# Altium schematic sheet RF_drv_v2.SchDoc: Материнская плата
size 420 x 297 mm; DrawnBy: В.Титов; DocumentNumber: ХХХХ.468179.001 Э3; SheetNumber: 1; SheetTotal: 3; DocumentType: Схема электрическая принципиальная; Title2: Питание процессора
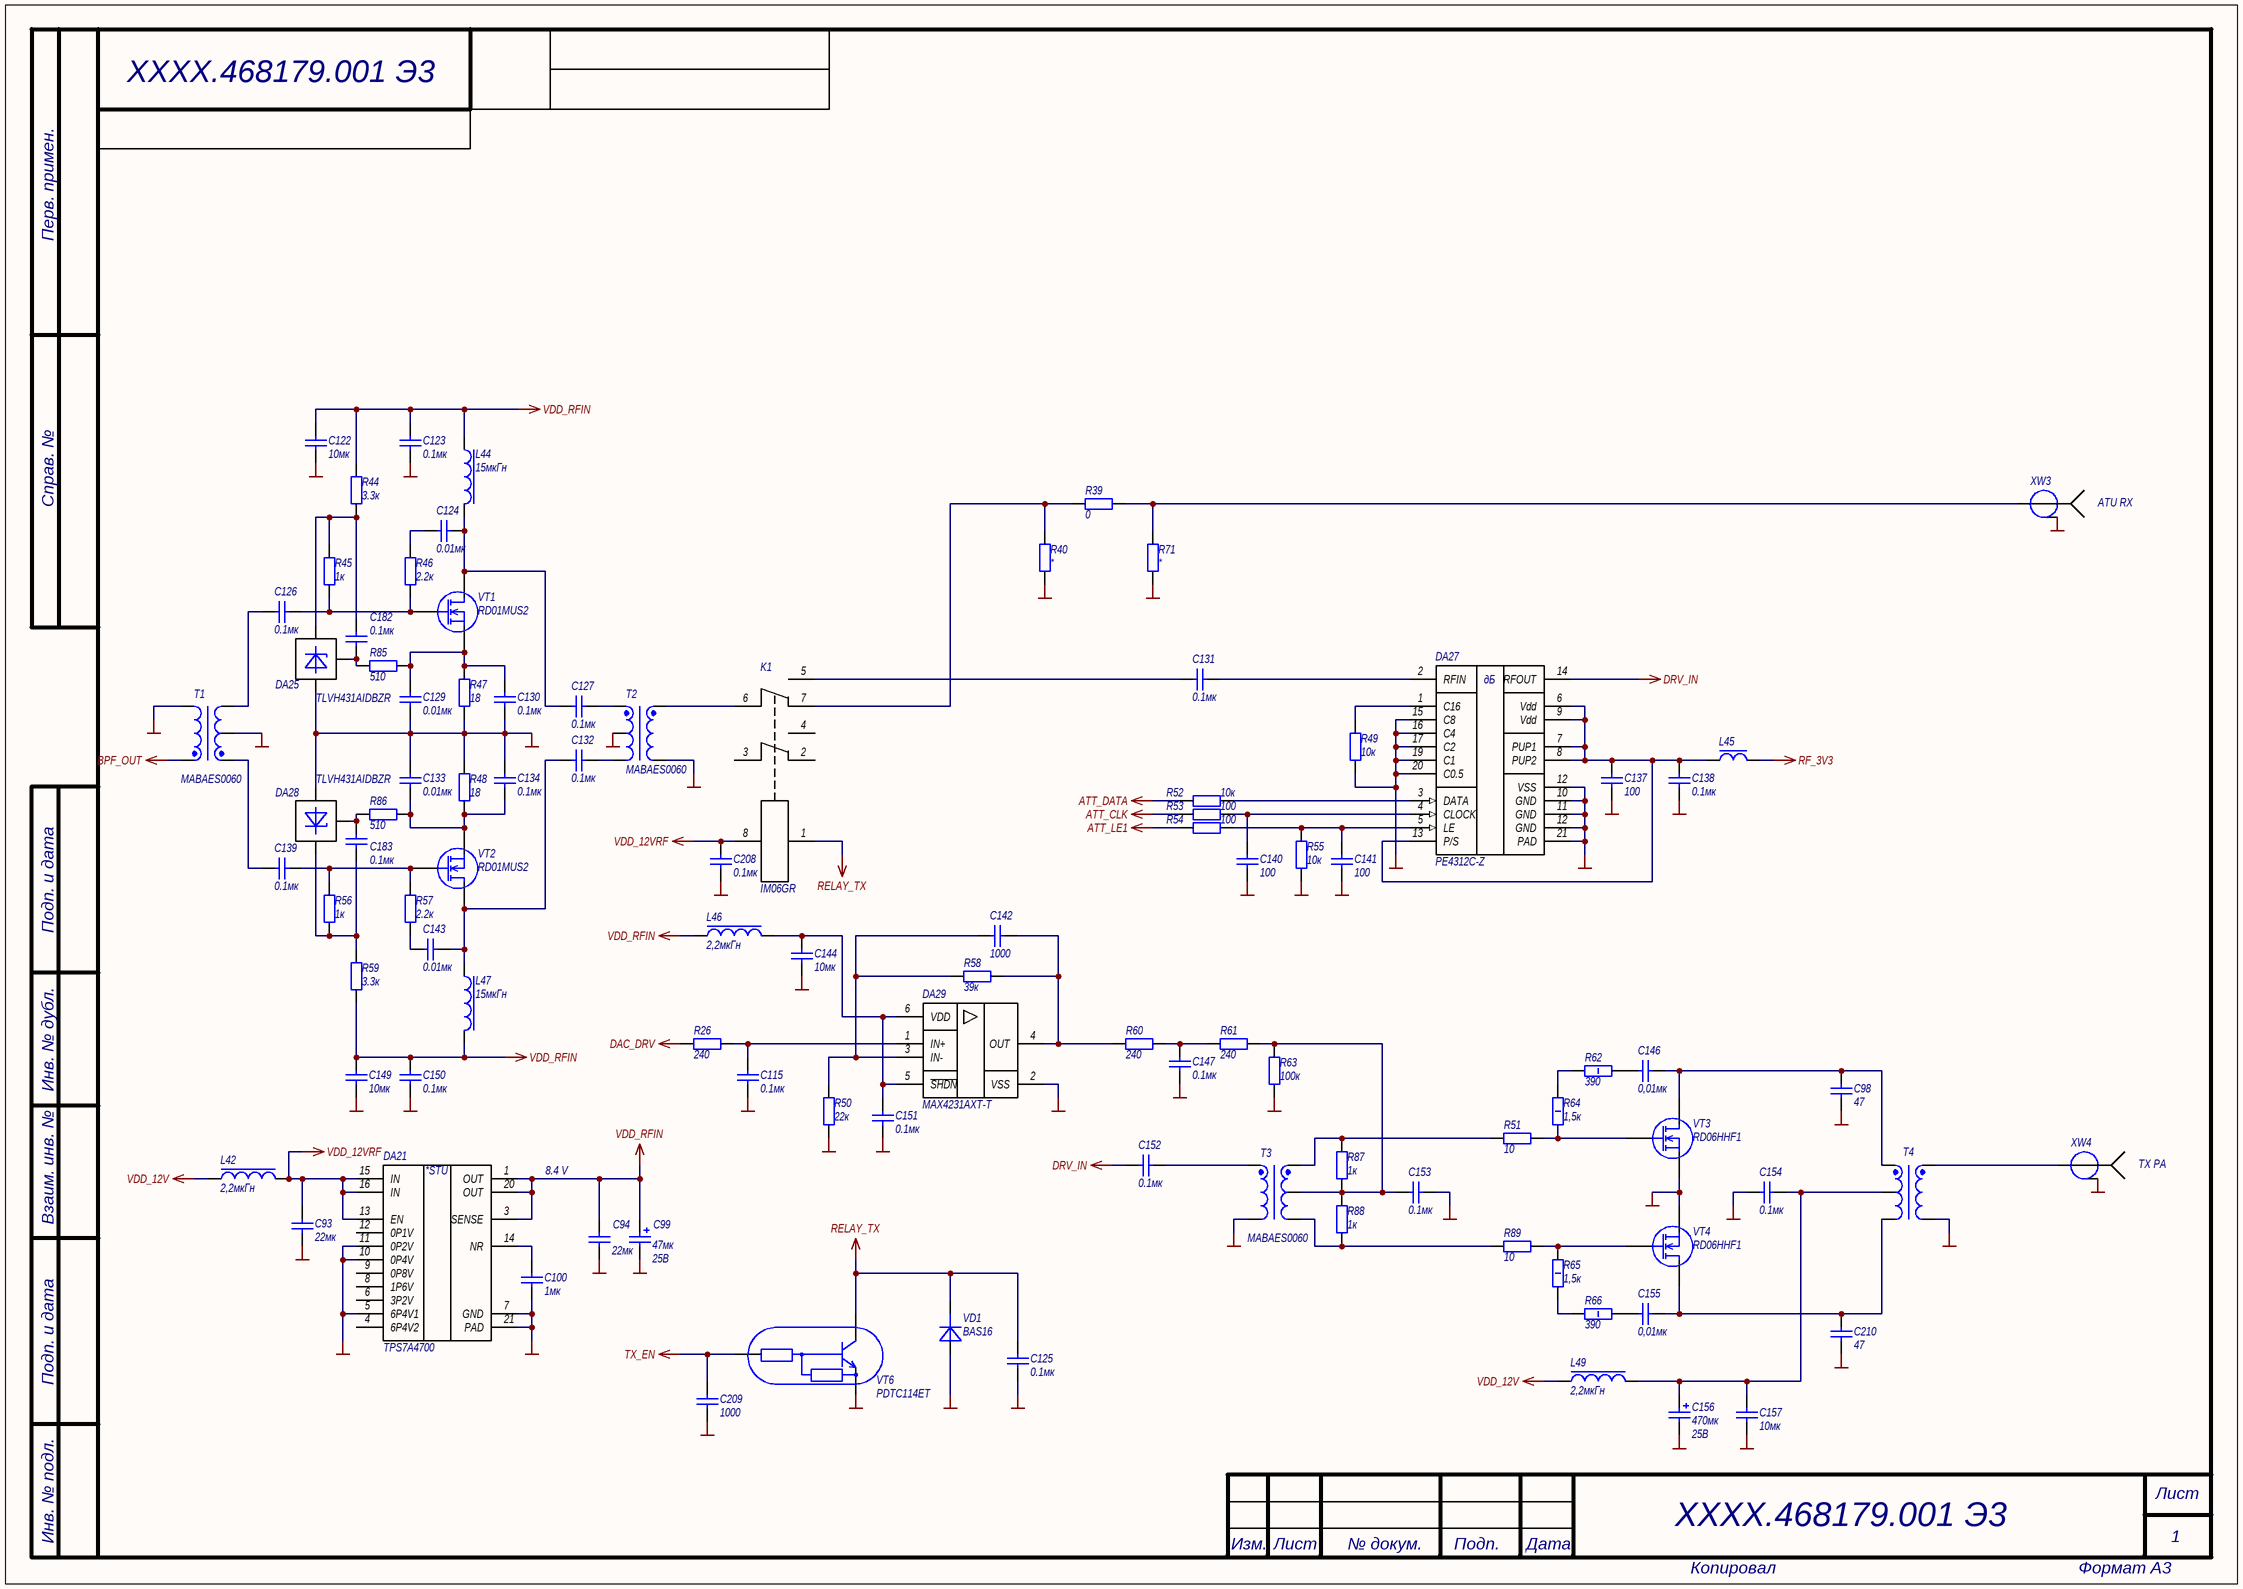
[diagram p0: RF_drv_v2.SchDoc]

## Parts
C93  22мк  [CAPC2012X12L]
C94  22мк  [CAPC2012X12L]
C98  47  [CAPC3216X19L]
C99  Power/Voltage: 25В  [CAPMP7343X28L]  (hidden comment: 47мк)
C100  1мк  [CAPC1005X06N]
C115  0.1мк  [CAPC1005X06N]
C122  10мк  [CAPC3225X27L]
C123  0.1мк  [CAPC1005X06N]
C124  0.01мк  [CAPC1005X06N]
C125  0.1мк  [CAPC1005X06N]
C126  0.1мк  [CAPC1005X06N]
C127  0.1мк  [CAPC1608X08L]
C129  0.01мк  [CAPC1005X06N]
C130  0.1мк  [CAPC1005X06N]
C131  0.1мк  [CAPC1608X08L]
C132  0.1мк  [CAPC1608X08L]
C133  0.01мк  [CAPC1005X06N]
C134  0.1мк  [CAPC1005X06N]
C137  100  [CAPC1005X06N]
C138  0.1мк  [CAPC1005X06N]
C139  0.1мк  [CAPC1005X06N]
C140  100  [CAPC1005X06N]
C141  100  [CAPC1005X06N]
C142  1000  [CAPC1005X06N]
C143  0.01мк  [CAPC1005X06N]
C144  10мк  [CAPC3225X27L]
C146  0,01мк  [CAPC2012X12L]
C147  0.1мк  [CAPC1005X06N]
C149  10мк  [CAPC3225X27L]
C150  0.1мк  [CAPC1005X06N]
C151  0.1мк  [CAPC1005X06N]
C152  0.1мк  [CAPC1608X08L]
C153  0.1мк  [CAPC1608X08L]
C154  0.1мк  [CAPC1608X08L]
C155  0,01мк  [CAPC2012X12L]
C156  Power/Voltage: 25В  [CAPAE116103X105N]  (hidden comment: 470мк)
C157  10мк  [CAPC3225X27L]
C182  0.1мк  [CAPC1005X06N]
C183  0.1мк  [CAPC1005X06N]
C208  0.1мк  [CAPC1005X06N]
C209  1000  [CAPC1005X06N]
C210  47  [CAPC3216X19L]
DA21  TPS7A4700  [QFN65P500X500X100_HS-21L]
DA25  TLVH431AIDBZR  [SOT23_N]
DA27  PE4312C-Z  [QFN50P400X400X80_HS-21L]
DA28  TLVH431AIDBZR  [SOT23_N]
DA29  MAX4231AXT-T  [TSOP65P210X100-6L]
K1  IM06GR  [IM Relay GR]
L42  2,2мкГн  [CSAB0420]
L44  15мкГн  [Coilcraft-1812FS]
L45  BLM18PG121SN1D  [INDC1608X08L]  (value not drawn)
L46  2,2мкГн  [CSAB0420]
L47  15мкГн  [Coilcraft-1812FS]
L49  2,2мкГн  [CSAB0420]
R26  240  [RESC1005X06N]
R39  0  [RESC1005X06N]
R40  *  [RESC1005X06N]
R44  3.3к  [RESC1005X06N]
R45  1к  [RESC1005X06N]
R46  2.2к  [RESC1005X06N]
R47  18  [RESC2012X05L]
R48  18  [RESC2012X05L]
R49  10к  [RESC1005X06N]
R50  22к  [RESC1005X06N]
R51  10  [RESC1005X06N]
R52  10к  [RESC1005X06N]
R53  100  [RESC1005X06N]
R54  100  [RESC1005X06N]
R55  10к  [RESC1005X06N]
R56  1к  [RESC1005X06N]
R57  2.2к  [RESC1005X06N]
R58  39к  [RESC1005X06N]
R59  3.3к  [RESC1005X06N]
R60  240  [RESC1005X06N]
R61  240  [RESC1005X06N]
R62  390  [RESC3216X04L]
R63  100к  [RESC1005X06N]
R64  1,5к  [RESC3216X04L]
R65  1,5к  [RESC3216X04L]
R66  390  [RESC3216X04L]
R71  *  [RESC1005X06N]
R85  510  [RESC1005X06N]
R86  510  [RESC1005X06N]
R87  1к  [RESC1005X06N]
R88  1к  [RESC1005X06N]
R89  10  [RESC1005X06N]
T1  MABAES0060  [SM-22 package]
T2  MABAES0060  [SM-22 package]
T3  MABAES0060  [SM-22 package]
T4  Трансформатор PUM_OUT  [Transformer_KV_PA20_0UT_2xBN-43-302_V1]  (value not drawn)
VD1  BAS16  [SOT23_N]
VT1  RD01MUS2  [SOT89-150P330X160-3N]
VT2  RD01MUS2  [SOT89-150P330X160-3N]
VT3  RD06HHF1  [TO-220HS]
VT4  RD06HHF1  [TO-220HS]
VT6  PDTC114ET  [SOT23_N]
XW3  SMA-JR  [SMA-JR]  (value not drawn)
XW4  SMA-JR  [SMA-JR]  (value not drawn)

## Nets
ATT_CLK: R53.2
ATT_DATA: R52.2
ATT_LE1: R54.2
BPF_OUT: T1.5(PRIMARY_DOT)
DAC_DRV: R26.1
DRV_IN: C152.2 DA27.14(RFOUT)
GND: C93.1 C94.1 C98.2 C99.2 C100.1 C115.2 C122.1 C123.2 C125.2 C129.2 C130.2 C133.1 C134.1 C137.1 C138.1 C140.1 C141.1 C144.1 C147.2 C149.1 C150.2 C151.2 C153.1 C154.1 C156.2 C157.1 C208.2 C209.2 C210.2 DA21.5(6P4V1) DA21.7(GND) DA21.10(0P4V) DA21.11(0P2V) DA21.21(PAD) DA25.3(A) DA27.10(GND) DA27.11(GND) DA27.12(VSS) DA27.15(C8) DA27.16(C4) DA27.17(C2) DA27.19(C1) DA27.20(C0.5) DA27.21(PAD) DA28.3(A) DA29.2(VSS) R40.2 R47.2 R48.1 R49.1 R50.1 R55.2 R63.2 R71.2 T1.2(SECONARY_CT) T1.4(PRIMARY) T2.2(SECONARY_CT) T2.4(PRIMARY) T3.4(PRIMARY) T4.5(SECONDARY) VD1.1(A) VT3.2(S) VT4.2(S) VT6.2(E) XW3.2 XW4.2
RELAY_TX: C125.1 K1.1 VD1.3(K) VT6.3(C)
RF_3V3: L45.2
TX_EN: C209.1 VT6.1(B)
VDD_12V: L42.1 L49.1
VDD_12VRF: C93.2 C208.1 DA21.13(EN) DA21.15(IN) DA21.16(IN) K1.8 L42.2
VDD_RFIN: C94.2 C99.1 C122.2 C123.1 C149.2 C150.1 DA21.1(OUT) DA21.3(SENSE) DA21.20(OUT) L44.1 L46.1 L47.2 R44.2 R59.1
NetC98_1: C98.1 C146.1 T4.3(PRIMARY_DOT) VT3.3(D)
NetC100_2: C100.2 DA21.14(NR)
NetC115_1: C115.1 DA29.1(IN+) R26.2
NetC124_1: C124.1 R46.1
NetC124_2: C124.2 C127.2 L44.2 VT1.3(D)
NetC126_1: C126.1 R45.2 R46.2 VT1.1(GATE)
NetC126_2: C126.2 T1.3(SECONDARY)
NetC127_1: C127.1 T2.1(SECONDARY_DOT)
NetC129_1: C129.1 C130.1 R47.1 R85.2 VT1.2(S)
NetC131_1: C131.1 DA27.2(RFIN)
NetC131_2: C131.2 K1.5
NetC132_1: C132.1 T2.3(SECONDARY)
NetC132_2: C132.2 C143.2 L47.1 VT2.3(D)
NetC133_2: C133.2 C134.2 R48.2 R86.2 VT2.2(S)
NetC137_2: C137.2 C138.2 DA27.6(Vdd) DA27.7(PUP1) DA27.8(PUP2) DA27.9(Vdd) DA27.13(P/S) L45.1
NetC139_1: C139.1 R56.1 R57.1 VT2.1(GATE)
NetC139_2: C139.2 T1.1(SECONDARY_DOT)
NetC140_2: C140.2 DA27.4(CLOCK) R53.1
NetC141_2: C141.2 DA27.5(LE) R54.1 R55.1
NetC142_1: C142.1 DA29.3(IN-) R50.2 R58.1
NetC142_2: C142.2 DA29.4(OUT) R58.2 R60.1
NetC143_1: C143.1 R57.2
NetC144_2: C144.2 C151.1 DA29.5(GND) DA29.6(VDD) L46.2
NetC146_2: C146.2 R62.2
NetC147_1: C147.1 R60.2 R61.1
NetC152_1: C152.1 T3.5(PRIMARY_DOT)
NetC153_2: C153.2 R61.2 R63.1 R87.2 R88.1 T3.2(SECONARY_CT)
NetC154_2: C154.2 C156.1 C157.2 L49.2 T4.2(CT)
NetC155_1: C155.1 C210.1 T4.1(PRIMARY) VT4.3(D)
NetC155_2: C155.2 R66.2
NetC182_1: C182.1 DA25.2(K) R44.1 R45.1
NetC182_2: C182.2 DA25.1(REF) R85.1
NetC183_1: C183.1 DA28.1(REF) R86.1
NetC183_2: C183.2 DA28.2(K) R56.2 R59.2
NetDA27_1: DA27.1(C16) R49.2
NetDA27_3: DA27.3(DATA) R52.1
NetK1_6: K1.6 T2.5(PRIMARY_DOT)
NetK1_7: K1.7 R39.1 R40.1
NetR39_2: R39.2 R71.1 XW3.1
NetR51_1: R51.1 R87.1 T3.1(SECONDARY_DOT)
NetR51_2: R51.2 R64.1 VT3.1(GATE)
NetR62_1: R62.1 R64.2
NetR65_1: R65.1 R66.1
NetR65_2: R65.2 R89.2 VT4.1(GATE)
NetR88_2: R88.2 R89.1 T3.3(SECONDARY)
NetT4_4: T4.4(SECONDARY_DOT) XW4.1

Not connected (* = marked no-connect by the designer): DA21 4(6P4V2) 6(3P2V) 8(1P6V) 9(0P8V) 12(0P1V); K1 2 3 4

## Notes on the sheet
- ATU RX
- 8.4 V
- TX PA
- Перв. примен.
- Справ. №
- Подп. и дата
- Инв. № дубл.
- Взаим. инв. №
- Инв. № подл.
- Лист
- Изм.
- № докум.
- Подп.
- Дата
- Копировал
- Формат А3
- (in symbol Микросхема PE4312C-Z) дБ
- (in symbol Микросхема TPS7A4700RGW) *STU

## Library data of the parts
C93 C94 = Кер.ЧИП конд. 0805 22мкФ X5R 10% 16В: Кер. ЧИП-конденсатор; Manufacturer: TDK; ManufacturerPartNumber: C2012X5R1C226KT; Power/Voltage: 16В; TKE: X5R; Tolerance: ±10%; Value: 22мк
C98 C210 = Кер.ЧИП конд. 1206 47пФ NP0 5% 2000В: Кер. ЧИП-конденсатор; Manufacturer: WALSIN; ManufacturerPartNumber: 1206N470J202; Power/Voltage: 2000В; TKE: NP0; Tolerance: ±5%; Value: 47
C99 = Конденсатор танталовый SMD D case 47мкФ ±10% 25B: Тант. ЧИП-конденсатор; Tolerance: ±10%; Published: 8-Jun-2000; LatestRevisionDate: 29-May-2009; LatestRevisionNote: IPC-7351 Footprint Added.; Publisher: Altium Limited; PackageDescription: Chip Capacitor; PackageReference: тип D; Value: 47мк
C100 = Кер.ЧИП конд. 0402 1мкФ X5R 10%, 10В: Кер. ЧИП-конденсатор; Power/Voltage: 10В; TKE: X5R; Tolerance: ±10%; PackageReference: 0402; Value: 1мк
C115 C123 C125 C126 C130 C134 C138 C139 C147 C150 C151 C182 C183 C208 = Кер.ЧИП конд. 0402 0.1мкФ X7R 10%, 16В: Кер. ЧИП-конденсатор; Power/Voltage: 16В; TKE: X7R; Tolerance: ±10%; PackageReference: 0402; Value: 0.1мк
C122 C144 C149 C157 = Кер.ЧИП конд. 1210 10мкФ X5R 20% 50В: Кер. ЧИП-конденсатор; Manufacturer: Murata; ManufacturerPartNumber: GRM32ER71H106; Power/Voltage: 50В; TKE: X5R; Tolerance: ±20%; Value: 10мк
C124 C129 C133 C143 = Кер.ЧИП конд. 0402 0.01мкФ X7R 10%, 50В: Кер. ЧИП-конденсатор; Power/Voltage: 50В; TKE: X7R; Tolerance: ±20%; Value: 0.01мк
C127 C131 C132 C152-C154 = Кер.ЧИП конд. 0603 0.1мкФ X7R 10% 50В: Кер. ЧИП-конденсатор; Manufacturer: Murata; ManufacturerPartNumber: GRM188R71H104KA93D; Power/Voltage: 50В; TKE: X7R; Tolerance: ±10%; Value: 0.1мк
C137 C140 C141 = Кер.ЧИП конд. 0402 100пФ NPO 5%, 50В: Кер. ЧИП-конденсатор; Power/Voltage: 50В; TKE: NPO; Tolerance: ±5%; PackageReference: 0402; Value: 100
C142 C209 = Кер.ЧИП конд. 0402 1000пФ NP0 5%, 50В: Кер. ЧИП-конденсатор; Power/Voltage: 50В; TKE: NPO; Tolerance: ±5%; PackageReference: 0402; Value: 1000
C146 C155 = Кер.ЧИП конд. 0805 0,01 мкФ X7R 10% 250В: Кер. ЧИП-конденсатор; Manufacturer: Murate; ManufacturerPartNumber: GRM21BR72E103KW03; Power/Voltage: 250В; TKE: X7R; Tolerance: ±10%; Value: 0,01мк
C156 = Конденсатор гибридный SMD 470мкФ ±20% 25В: Гибридный ЧИП-конденсатор; ManufacturerPartNumber: EEHZK1E471P; Manufacturer: Panasonic; Tolerance: ±20%; Published: 8-Jun-2000; LatestRevisionDate: 29-May-2009; LatestRevisionNote: IPC-7351 Footprint Added.; Publisher: Altium Limited; PackageDescription: ZK series; PackageReference: ZK series; Value: 470мк
DA21 = Микросхема TPS7A4700RGW: 36-V, 1-A, 4-µVRMS, RF LDO Voltage Regulator; Manufacturer: TI; Value: TPS7A4700; ComponentLink1Description: datasheet; ComponentLink1URL: http://www.ti.com/lit/ds/symlink/tps7a47.pdf
DA25 DA28 = ЧИП регулятор TLVH431AIDBZR: Low-Voltage Adjustable Precision Shunt Regulator; Manufacturer: TI; Power/Voltage: 1.24В до 18В; ManufacturerPartNumber: TLVH431AIDBZR; Value: TLVH431AIDBZR; ComponentLink1Description: datasheet; ComponentLink1URL: https://www.ti.com/lit/ds/symlink/tlvh431a.pdf?ts=1606914625003&ref_url=https%253A%252F%252Fwww.google.com%252F
DA27 = Микросхема PE4312C-Z: RF Digital Step Attenuator 6-bit, 31.5 dB, 1 MHz–4 GHz; Manufacturer: Peregrine; Value: PE4312C-Z; ComponentLink1Description: datasheet; ComponentLink1URL: https://www.psemi.com/pdf/datasheets/pe4312ds.pdf
DA29 = Микросхема MAX4231AXT-T: High-Output-Drive, 10MHz, 10V/μs,  Rail-to-Rail I/O Op Amps with Shutdown in SC70; Manufacturer: MAXIM; Value: MAX4231AXT-T; ComponentLink1Description: datasheet; ComponentLink1URL: https://datasheets.maximintegrated.com/en/ds/MAX4230-MAX4234.pdf
K1 = Реле IM06GR: Signal Relay 12VDC; Value: IM06GR; ComponentLink1Description: datasheet; ComponentLink1URL: https://www.te.com/commerce/DocumentDelivery/DDEController?Action=srchrtrv&DocNm=1-1773734-7_IM_Relay_I_Type&DocType=DS&DocLang=English
L42 L46 L49 = ЧИП индуктивность CSAB0420-2R2M: Molding Power Choke; Manufacturer: Vishay; ManufacturerPartNumber: IHLP1616ABER1R0M11; Value: 2,2мкГн
L44 L47 = ЧИП индуктивность 1812FS-153: High SRF, High Current Inductors; Manufacturer: Сoilcraft; ManufacturerPartNumber: 1812PS-683KLC; Value: 15мкГн
L45 = ЧИП дроссель 0603 BLM18PG121SN1D: SMD EMI Suppression Filter EMIFIL; Manufacturer: Murata; ManufacturerPartNumber: BLM18PG121SN1D; Value: BLM18PG121SN1D
R26 R60 R61 = Чип резистор 0402 240 Ом, 5%: ЧИП-резистор; Tolerance: ±5%; TKE: 100 ppm/°С; PackageReference: 0402; Value: 240
R39 = Чип резистор 0402 0 Ом: ЧИП-резистор; Tolerance: ±5%; TKE: 100 ppm/°С; PackageReference: 0402; Value: 0
R40 R71 = Чип резистор 0402 *: ЧИП-резистор; Tolerance: ±5%; TKE: 100 ppm/°С; PackageReference: 0402; Value: *
R44 R59 = Чип резистор 0402 3,3 кОм, 5%: ЧИП-резистор; Tolerance: ±5%; TKE: 100 ppm/°С; PackageReference: 0402; Value: 3.3к
R45 R56 R87 R88 = Чип резистор 0402 1 кОм, 5%: ЧИП-резистор; Tolerance: ±5%; TKE: 100 ppm/°С; PackageReference: 0402; Value: 1к
R46 R57 = Чип резистор 0402 2,2 кОм, 5%: ЧИП-резистор; Tolerance: ±5%; TKE: 100 ppm/°С; PackageReference: 0402; Value: 2.2к
R47 R48 = Чип резистор 0805 18 Ом, 5%: ЧИП-резистор; Tolerance: ±5%; TKE: 100 ppm/°С; PackageReference: 0805; Value: 18
R49 R52 R55 = Чип резистор 0402 10 кОм, 5%: ЧИП-резистор; Tolerance: ±5%; TKE: 100 ppm/°С; PackageReference: 0402; Value: 10к
R50 = Чип резистор 0402 22 кОм, 5%: ЧИП-резистор; Tolerance: ±5%; TKE: 100 ppm/°С; PackageReference: 0402; Value: 22к
R51 R89 = Чип резистор 0402 10 Ом, 5%: ЧИП-резистор; Tolerance: ±5%; TKE: 100 ppm/°С; PackageReference: 0402; Value: 10
R53 R54 = Чип резистор 0402 100 Ом, 5%: ЧИП-резистор; Tolerance: ±5%; TKE: 100 ppm/°С; PackageReference: 0402; Value: 100
R58 = Чип резистор 0402 39 кОм, 5%: ЧИП-резистор; Tolerance: ±5%; TKE: 100 ppm/°С; PackageReference: 0402; Value: 39к
R62 R66 = Чип резистор 1206 390 Ом, 5%: ЧИП-резистор; Manufacturer: ROHM; Tolerance: ±5%; TKE: 300 ppm/°С; PackageReference: 1206; Value: 390
R63 = Чип резистор 0402 100 кОм, 5%: ЧИП-резистор; Tolerance: ±5%; TKE: 100 ppm/°С; PackageReference: 0402; Value: 100к
R64 R65 = Чип резистор 1206 1,5 кОм, 5%: ЧИП-резистор; Manufacturer: ROHM; Tolerance: ±5%; TKE: 300 ppm/°С; PackageReference: 1206; Value: 1,5к
R85 R86 = Чип резистор 0402 510 Ом, 5%: ЧИП-резистор; Tolerance: ±5%; TKE: 100 ppm/°С; PackageReference: 0402; Value: 510
T1-T3 = ЧИП трансформатор MABAES0060: RF 1:1 Flux Coupled Transformer 0.3 - 200 MHz; Manufacturer: MACOM; Value: MABAES0060; ComponentLink1Description: datasheet; ComponentLink1URL: https://cdn.macom.com/datasheets/MABAES0060.pdf; ManufacturerPartNumber: MABAES0060
T4 = Transformer_KV_PA20_OUT: Трансформатор на 2 биноклях BN-43-302 (2843000302)mu850 / Первичная обмотка - плетенка ПМЛ2х4 / Вторичная обмотка - 2 витка проводом МГТФ 0,12; Manufacturer: НЕЛС; Manufacturer Part Number: Трансформатор PUM_OUT АНЕЛ.671143.003; SubType: Трансформатор на бинокле; Package: 2xBN-43-302 (2843000302) 13.3x10.3 mm; Type: Трансформатор
VD1 = ЧИП диод BAS16: High-speed switching diodes; Manufacturer: Nexperia; Power/Voltage: 100В; ManufacturerPartNumber: BAS16; Value: BAS16; ComponentLink1Description: datasheet; ComponentLink1URL: https://assets.nexperia.com/documents/data-sheet/BAS16_SER.pdf
VT1 VT2 = ЧИП транзистор RD01MUS2: Silicon MOSFET Power Transistor 520MHz, 1W, 7.2V; ComponentLink1Description: datasheet; ComponentLink1URL: https://www.mitsubishielectric.com/semiconductors/hf/products/datasheet/rd01mus2.pdf; Value: RD01MUS2
VT3 VT4 = ЧИП транзистор RD06HHF1: Silicon MOSFET Power Transistor 30MHz,6W; ComponentLink1Description: datasheet; ComponentLink1URL: https://www.radio-kits.co.uk/radio-related/Linear_PA/RD06HHF1_REV040402.pdf; Value: RD06HHF1
VT6 = ЧИП транзистор PDTC114ET: NPN resistor-equipped transistors;  R1 = 10 k, R2 = 10; ComponentLink1Description: datasheet; ComponentLink1URL: https://assets.nexperia.com/documents/data-sheet/PDTC114E_SER.pdf; Value: PDTC114ET
XW3 XW4 = Соединитель коаксиальный SMA-JR: SMA-JR Разъем SMA гнездо на плату, прямой угол; Value: SMA-JR; ComponentLink1Description: datasheet; ComponentLink1URL: http://www.brownbear.ru/goods/2243.html